# EAGLE design Mbus_2.0 (EAGLE 9.6.2)
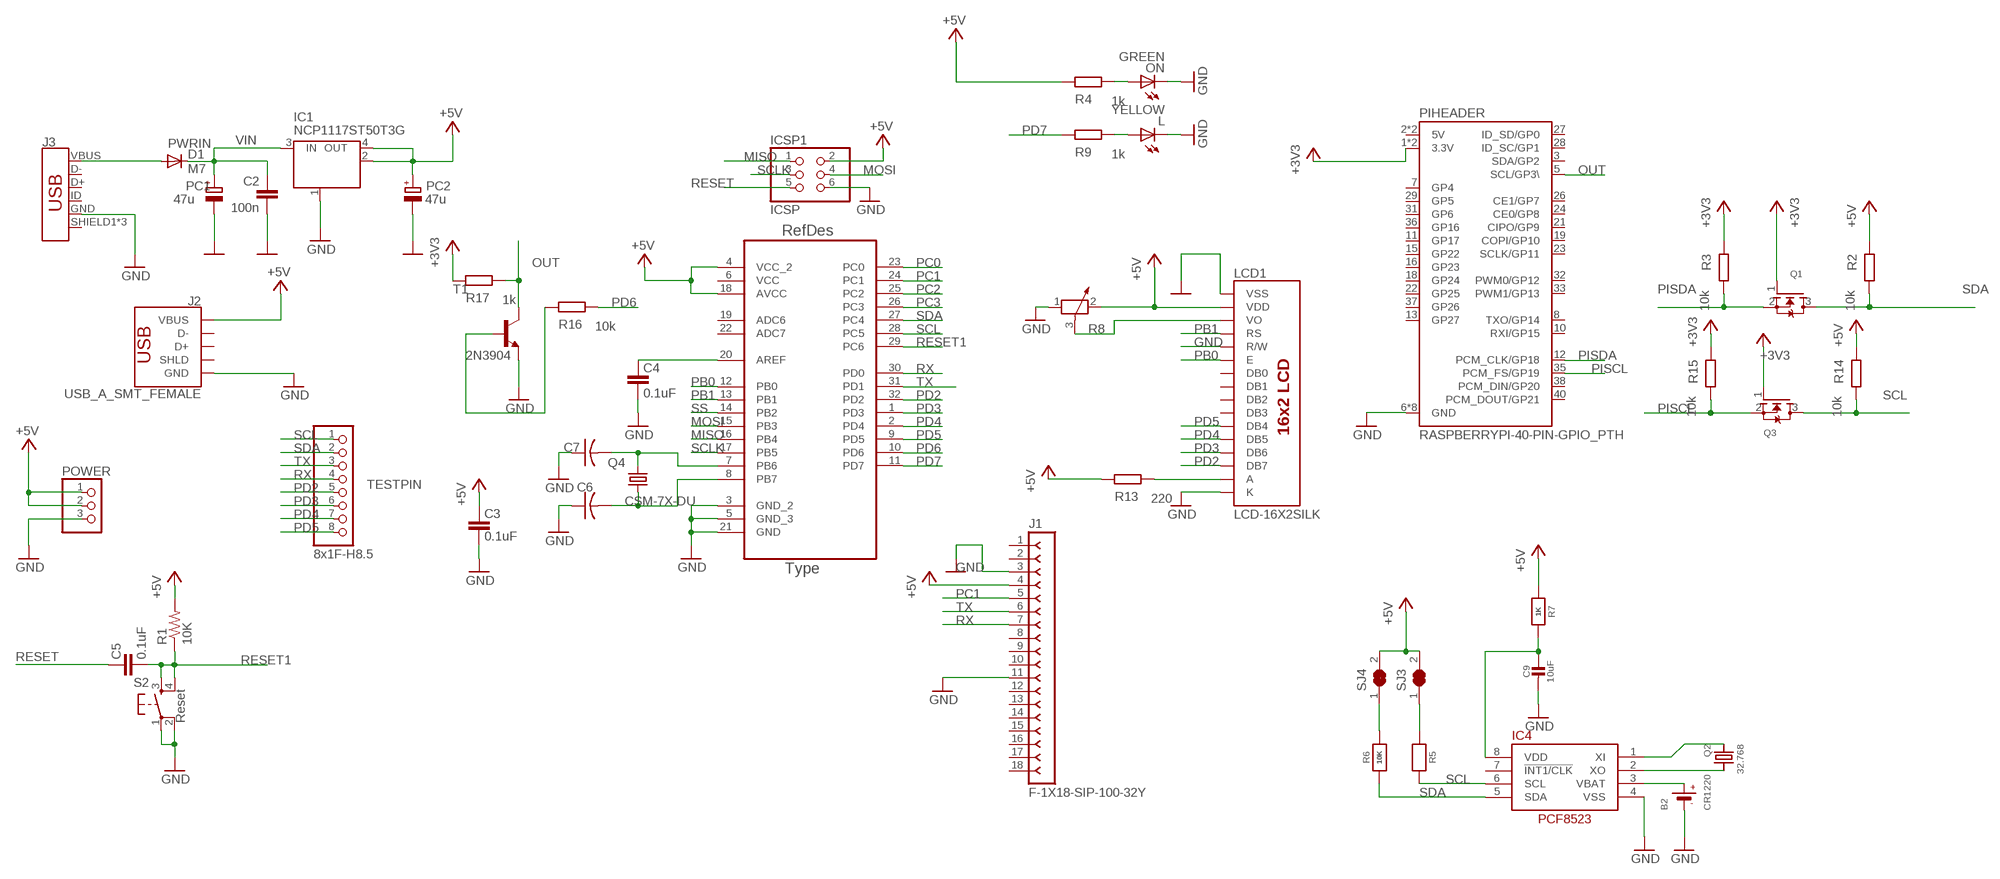
[diagram p0: schematic, sheet 1]

## Parts
B2  CR1220  BATTERYCR1220_SMT  [CR1220]
C2  100n  C-EU0603-RND  [C0603-ROUND]
C3  0.1uF  CAP0805  [0805]
C4  0.1uF  CAP0805  [0805]
C5  0.1uF  CAP0805  [0805]
C6  C-USC0805  [C0805]
C7  C-USC0805  [C0805]
C9  10uF  CAP_CERAMIC0805-NOOUTLINE  [0805-NO]
D1  M7  DIODE-SMB  [SMB]
IC1  NCP1117ST50T3G  MC33269ST-3.3T3  [SOT223]
IC4  RTC_PCF8523T  [SOIC8_150MIL]
ICSP1  ICSP  PINHD-2X3  [2X03]
J1  F-1X18-SIP-100-32Y  [SIP-100-18-32Y]
J2  USB_A_SMT_FEMALE  [USB-A-S-SILK-FEMALE]
J3  USB_MICRO-B_FEMALE-SMT  [USB-B-MICRO-SMD]
L  YELLOW  LEDCHIP-LED0805  [CHIP-LED0805]
LCD1  LCD-16X2SILK  [LCD-16X2]
ON  GREEN  LEDCHIP-LED0805  [CHIP-LED0805]
PC1  47u  CPOL-EUD  [PANASONIC_D]
PC2  47u  CPOL-EUD  [PANASONIC_D]
PIHEADER  RASPBERRYPI-40-PIN-GPIO_PTH  [2X20_SHROUDED]
POWER  PINHD-1X3  [1X03]
Q1  BSS138  MOSFET-NREFLOW  [SOT23]
Q2  32.768  CRYSTAL8.0X3.8  [CRYSTAL_8X3.8]
Q3  BSS138  MOSFET-NREFLOW  [SOT23]
Q4  CSM-7X-DU  [CSM-7X-DU]
R1  10K  RESISTOR  [0805]
R2  10k  R-EU_R0603  [R0603-ROUND]
R3  10k  R-EU_R0603  [R0603-ROUND]
R4  1k  R-EU_R0603  [R0603-ROUND]
R5  10K  RESISTOR0805_NOOUTLINE  [0805-NO]
R6  10K  RESISTOR0805_NOOUTLINE  [0805-NO]
R7  1K  RESISTOR0805_NOOUTLINE  [0805-NO]
R8  POTENTIOMETER_PT-10  [PT-10]
R9  1k  R-EU_R0603  [R0603-ROUND]
R13  220  R-EU_R0603  [R0603-ROUND]
R14  10k  R-EU_R0603  [R0603-ROUND]
R15  10k  R-EU_R0603  [R0603-ROUND]
R16  10k  R-EU_R0603  [R0603-ROUND]
R17  1k  R-EU_R0603  [R0603-ROUND]
S2  Reset  TAC_SWITCHSND  [TACTILE_SWITCH_SMD]
SJ3  SOLDERJUMPER_CLOSED  [SOLDERJUMPER_CLOSEDWIRE]
SJ4  SOLDERJUMPER_CLOSED  [SOLDERJUMPER_CLOSEDWIRE]
T1  2N3904  [TO92]
TESTPIN  8x1F-H8.5  PINHD-1X8  [1X08]
U1  ATMEGA328P-AU  [QFP80P900X900X120-32N]

## Nets
+3V3 [power]: PIHEADER.1(3.3V) PIHEADER.17(3.3V) Q1.1(G) Q3.1(G) R3.2 R15.2 R17.2
+5V [power]: C3.2 IC1.2(OUT) IC1.4(OUT) ICSP1.2 J1.4 J2.VBUS LCD1.2(VDD) PC2.+ POWER.1 POWER.2 R1.2 R2.2 R4.2 R7.1 R8.2 R13.2 R14.2 SJ3.2 SJ4.2 U1.4(VCC_2) U1.18(AVCC)
GND [gnd]: B2.- C2.2 C3.1 C4.1 C6.1 C7.1 C9.2 IC1.1(GND/ADJ) IC4.4(VSS) ICSP1.6 J1.3 J1.11 J2.GND J3.GND L.C LCD1.1(VSS) LCD1.5(R/W) LCD1.16(K) ON.C PC1.- PC2.- PIHEADER.6(GND) PIHEADER.9(GND) PIHEADER.14(GND) PIHEADER.20(GND) PIHEADER.25(GND) PIHEADER.30(GND) PIHEADER.34(GND) PIHEADER.39(GND) POWER.3 R8.1 S2.1 S2.2 T1.3(E) U1.3(GND_2) U1.5(GND_3) U1.21(GND)
MISO: ICSP1.1 U1.16(PB4)
MOSI: ICSP1.4 U1.15(PB3)
N$1: C6.2 Q4.1 U1.8(PB7)
N$2: L.A R9.1
N$3: ON.A R4.1
N$4: R16.2 T1.2(B)
N$6: IC4.1(XI) Q2.P$1
N$7: IC4.2(XO) Q2.P$4
N$8: R5.1 SJ3.1
N$9: R6.2 SJ4.1
N$10: C9.1 IC4.8(VDD) R7.2
N$11: LCD1.15(A) R13.1
N$13: C7.2 Q4.2 U1.7(PB6)
N$14: C4.2 U1.20(AREF)
N$22: LCD1.3(VO) R8.3
OUT: PIHEADER.5(SCL/GP3\) R17.1 T1.1(C)
PB0: LCD1.6(E) U1.12(PB0)
PB1: LCD1.4(RS) U1.13(PB1)
PC0: U1.23(PC0)
PC1: J1.5 U1.24(PC1)
PC2: U1.25(PC2)
PC3: U1.26(PC3)
PD2: LCD1.14(DB7) TESTPIN.5 U1.32(PD2)
PD3: LCD1.13(DB6) TESTPIN.6 U1.1(PD3)
PD4: LCD1.12(DB5) TESTPIN.7 U1.2(PD4)
PD5: LCD1.11(DB4) TESTPIN.8 U1.9(PD5)
PD6: R16.1 U1.10(PD6)
PD7: R9.2 U1.11(PD7)
PISCL: PIHEADER.35(PCM_FS/GP19) Q3.2(S) R15.1
PISDA: PIHEADER.12(PCM_CLK/GP18) Q1.2(S) R3.1
PWRIN [power]: D1.A J3.VBUS
RESET: C5.2 ICSP1.5
RESET1: C5.1 R1.1 S2.3 S2.4 U1.29(PC6)
RX: J1.7 TESTPIN.4 U1.30(PD0)
SCL: IC4.6(SCL) Q3.3(D) R5.2 R14.1 TESTPIN.1 U1.28(PC5)
SCLK: ICSP1.3 U1.17(PB5)
SDA: IC4.5(SDA) Q1.3(D) R2.1 R6.1 TESTPIN.2 U1.27(PC4)
SS: U1.14(PB2)
TX: J1.6 TESTPIN.3 U1.31(PD1)
VBAT1: B2.+$1(+) IC4.3(VBAT)
VIN [power]: C2.1 D1.C IC1.3(IN) PC1.+
Unconnected: IC4.7(!INT1/CLK) J1.1 J1.2 J1.8 J1.9 J1.10 J1.12 J1.13 J1.14 J1.15 J1.16 J1.17 J1.18 J2.D+ J2.D- J2.SHLD1(SHLD) J2.SHLD2(SHLD) J3.D+ J3.D- J3.ID J3.SHIELD1(SHIELD) J3.SHIELD2(SHIELD) J3.SHIELD3(SHIELD) LCD1.7(DB0) LCD1.8(DB1) LCD1.9(DB2) LCD1.10(DB3) PIHEADER.3(SDA/GP2) PIHEADER.7(GP4) PIHEADER.8(TXO/GP14) PIHEADER.10(RXI/GP15) PIHEADER.11(GP17) PIHEADER.13(GP27) PIHEADER.15(GP22) PIHEADER.16(GP23) PIHEADER.18(GP24) PIHEADER.19(COPI/GP10) PIHEADER.21(CIPO/GP9) PIHEADER.22(GP25) PIHEADER.23(SCLK/GP11) PIHEADER.24(CE0/GP8) PIHEADER.26(CE1/GP7) PIHEADER.27(ID_SD/GP0) PIHEADER.28(ID_SC/GP1) PIHEADER.29(GP5) PIHEADER.31(GP6) PIHEADER.32(PWM0/GP12) PIHEADER.33(PWM1/GP13) PIHEADER.36(GP16) PIHEADER.37(GP26) PIHEADER.38(PCM_DIN/GP20) PIHEADER.40(PCM_DOUT/GP21) U1.19(ADC6) U1.22(ADC7)

## Power pins joined to a net without a drawn wire
5V: PIHEADER.2(5V) PIHEADER.4(5V)
VCC: U1.6(VCC)

## Library data of the parts
B2 = microbuilder:BATTERY: CR1220 SMT - Digikey: 3001K-ND CD2032 BAT-HLD-001 - Digikey: BAT-HLD-001-ND
C2 = SmartPrj:C-EU: CAPACITOR, European symbol
C3-C5 = SparkFun:CAP: Capacitor Standard 0603 ceramic capacitor, and 0.1" leaded capacitor.
C6 C7 = rcl:C-US: CAPACITOR, American symbol
C9 = microbuilder:CAP_CERAMIC: Ceramic Capacitors For new designs, use the packages preceded by an '_' character since they are more reliable: The following footprints should be used on most boards: _0402 - Standard footprint for regular board layouts _0603 - Standard footprint for regular board layouts _0805 - Standard footprint for regular board layouts _1206 - Standard footprint for regular board layouts For extremely tight-pitch boards where space is at a premium, the following 'micro-pitch' footprints can be used (smaller pads, no silkscreen outline, etc.): _0402MP - Micro-pitch footprint for very dense/compact boards _0603MP - Micro-pitch footprint for very dense/compact boards _0805MP - Micro-pitch footprint for very dense/compact boards _1206MP - Micro-pitch footprint for very dense/compact boards
D1 = diode:DIODE-: DIODE
IC1 = linear:MC33269ST*: Adjustable Output Low Dropout Voltage Regulator 800 mA Source: http://www.onsemi.com/pub/Collateral/MC33269-D.PDF
IC4 = microbuilder:RTC_PCF8523
ICSP1 = pinhead:PINHD-2X3: PIN HEADER
J1 = con-headers-jp:F-1X18-: FEMALE HEADER
J2 = SparkFun-Connectors:USB_A: USB-A Connector Male and female variants, as well as PTH and SMT variants SparkFun Products: SparkFun XBee Explorer Dongle <https://www.sparkfun.com/products/11697> PTH Male SparkFun MicroView-USB Programmer <https://www.sparkfun.com/products/12924> SMT Male SparkFun USB Type A Female Breakout <https://www.sparkfun.com/products/12700> SMT Female; PROD_ID: CONN-09520; SF_ID: PRT-09011
J3 = SparkFun-Connectors:USB_MICRO-B: USB Type Micro-B Connector Male/female and PTH/SMT variants SparkFun Products: SparkFun microB USB Breakout <https://www.sparkfun.com/products/12035> SparkFun USB microB Plug Breakout <https://www.sparkfun.com/products/10031> SparkFun ESP8266 Thing <https://www.sparkfun.com/products/13231>; PROD_ID: CONN-11752
L ON = led:LED: LED OSRAM: - CHIPLED LG R971, LG N971, LY N971, LG Q971, LY Q971, LO R971, LY R971 LH N974, LH R974 LS Q976, LO Q976, LY Q976 LO Q996 - Hyper CHIPLED LW Q18S LB Q993, LB Q99A, LB R99A - SideLED LS A670, LO A670, LY A670, LG A670, LP A670 LB A673, LV A673, LT A673, LW A673 LH A674 LY A675 LS A676, LA A676, LO A676, LY A676, LW A676 LS A679, LY A679, LG A679 - Hyper Micro SIDELED® LS Y876, LA Y876, LO Y876, LY Y876 LT Y87S - SmartLED LW L88C, LW L88S LB L89C, LB L89S, LG L890 LS L89K, LO L89K, LY L89K LS L896, LA L896, LO L896, LY L896 - TOPLED LS T670, LO T670, LY T670, LG T670, LP T670 LSG T670, LSP T670, LSY T670, LOP T670, LYG T670 LG T671, LOG T671, LSG T671 LB T673, LV T673, LT T673, LW T673 LH T674 LS T676, LA T676, LO T676, LY T676, LB T676, LH T676, LSB T676, LW T676 LB T67C, LV T67C, LT T67C, LS T67K, LO T67K, LY T67K, LW E67C LS E67B, LA E67B, LO E67B, LY E67B, LB E67C, LV E67C, LT E67C LW T67C LS T679, LY T679, LG T679 LS T770, LO T770, LY T770, LG T770, LP T770 LB T773, LV T773, LT T773, LW T773 LH T774 LS E675, LA E675, LY E675, LS T675 LS T776, LA T776, LO T776, LY T776, LB T776 LHGB T686 LT T68C, LB T68C - Hyper Mini TOPLED® LB M676 - Mini TOPLED Santana® LG M470 LS M47K, LO M47K, LY M47K Source: http://www.osram.convergy.de/
LCD1 = SparkFun-Displays:LCD-16X2: Standard text-only 16x2 parallel input LCD Basic 16 character by 2 line display. Typically utilizes the extremely common HD44780 parallel interface chipset SparkFun Products: Basic 16x2 Green <https://www.sparkfun.com/products/255> Basic 8x2 Green <https://www.sparkfun.com/products/11122>; PROD_ID: LCD-12633; SF_ID: LCD-00255
PC1 PC2 = rcl:CPOL-EU: POLARIZED CAPACITOR, European symbol
PIHEADER = SparkFun-Connectors:RASPBERRYPI-40-PIN-GPIO: Raspberry Pi GPIO Header 2x20 pin connector, as found on B, B+, A+ models. Both shrouded PTH and SMT versions available. SparkFun Products: GPIO Shrouded Header <https://www.sparkfun.com/products/13054>- PTH SparkFun Pi Wedge (Preassembled) <https://www.sparkfun.com/products/13717>; PROD_ID: CONN-12263; SF_ID: PRT-13054
POWER = pinhead:PINHD-1X3: PIN HEADER
Q1 Q3 = adafruit:MOSFET-N: N-Channel Mosfet 2N7002E - 60V 260mA SOT23 [Digikey: 2N7002ET1GOSTR-ND] - REEL BSH103 - 30V 850mA SOT23 [Digikey: 568-5013-1-ND]
Q2 = microbuilder:CRYSTAL: Crystals HC49UP - Surface Mount Crystal 4.0MHz 18pF +/-30ppm Surface Mount Crystal [Digikey: 535-9857-1-ND] 12.0 MHz Surface Mount Crystal [Digikey: 535-9869-6-ND] 25.0 MHz Surface Mount Crystal [Digikey: 535-9078-1-ND] 2.5 x 2.0mm - MEMs SMT Crystal 16.0 MHz 10pF 20ppm 2.5 x 2.0mm Crystal [Digikey -40-85°C: 535-10923-1-ND] 3.2 x 2.5mm - MEMs SMT Crystal 12.0 MHz 8pF 15ppm 3.2 x 2.5mm Crystal [Digikey: -10-70°C: 644-1047-1-ND -40-125°C: 644-1128-1-ND] 40~85°C cheaper: 644-1173-6-ND 16.0 MHz 8pF 15ppm 3.2 x 2.5mm Crystal [Digikey: -10-70°C: 644-1049-1-ND -40-125°C: 644-1129-2-ND]-40~85°C cheaper: 644-1175-6-ND 16.0 MHz 10pF 10ppm 3.2 x 2.5mm Crystal [Digikey: 644-1100-1-ND] 27.12 MHz 18pF 30ppm 3.2 x 2.5mm Crystal [Digikey: 887-1424-1-ND] 27.12MHz 10pF 10ppm 3.2 x 2.5mm Crystal [Digikey: 887-1329-1-ND] 4.9 x 1.8mm - MEMs SMT Crystal 32.768 KHz 12.5pF 20ppm 4.9 x 1.8mm Crystal [Digikey: SE2415CT-ND] 8.0 x 3.8mm - Surface Mount Crystal 32.768kHz 12.5pF 20ppm -40°C-85°C [Digikey: 535-9166-2-ND] Cylinder 32.768KHz Cylinder Crystal (2x6mm body) [Ex. Digikey: 300-8341-2-ND]
Q4 = crystal:CSM-7X-DU: SMD CRYSTAL Source: www.ecsxtal.com .. Crystal 3.6864MHz CSM_7X_DU.PDF; OC_FARNELL: unknown; OC_NEWARK: unknown
R1 = SparkFun:RESISTOR: Resistor Basic schematic elements and footprints for 0603, 1206, and PTH 1/10th watt (small) resistors.
R2-R4 R9 R13-R17 = SmartPrj:R-EU_: RESISTOR, European symbol
R5-R7 = microbuilder:RESISTOR: Resistors For new designs, use the packages preceded by an '_' character since they are more reliable: The following footprints should be used on most boards: _0402 - Standard footprint for regular board layouts _0603 - Standard footprint for regular board layouts _0805 - Standard footprint for regular board layouts _1206 - Standard footprint for regular board layouts For extremely tight-pitch boards where space is at a premium, the following 'micro-pitch' footprints can be used (smaller pads, no silkscreen outline, etc.): _0402MP - Micro-pitch footprint for very dense/compact boards _0603MP - Micro-pitch footprint for very dense/compact boards _0805MP - Micro-pitch footprint for very dense/compact boards _1206MP - Micro-pitch footprint for very dense/compact boards
R8 = rcl@1:POTENTIOMETER_: Potentiometer; SPICEMODEL: POT; SPICEPREFIX: X
S2 = SparkFun:TAC_SWITCH: Momentary Switch Button commonly used for reset or general input. Spark Fun Electronics SKU : COM-00097
SJ3 SJ4 = microbuilder:SOLDERJUMPER_CLOSED: Solder Jumper - Closed These solder jumpers are closed by default CLOSEDWIRE - 10 mil trace between pads that can be cut and resoldered later CLOSEDPERM - 63 mil trace between pads for a permanent connection (used to 'bridge' two signals, a shameless hack for Eagle). Can double as a test point as well (no cream layer)
T1 = transistor:2N3904: NPN TRANSISTOR
TESTPIN = SmartPrj:PINHD-1X8: PIN HEADER
U1 = Atmel-ATMEGA328P-AU:ATMEGA328P-AU; DESCRIPTION: 8-bit Microcontroller with In-System Programmable Flash; MPN: ATMEGA328P-AU; OC_FARNELL: 1715486; OC_NEWARK: 14R4631; PACKAGE: TQFP-32; SUPPLIER: Atmel

## Net classes
0 default: width 0.203 mm, drill 0.254 mm, clearance 0.203 mm
1 power: width 0.813 mm, drill 0.864 mm, clearance 0.254 mm
2 gnd: width 0.61 mm, drill 0.66 mm, clearance 0.254 mm
3 usbvcc: width 0.508 mm, drill 0.508 mm, clearance 0.254 mm
4 aref: width 0.406 mm, clearance 0.254 mm

## Board
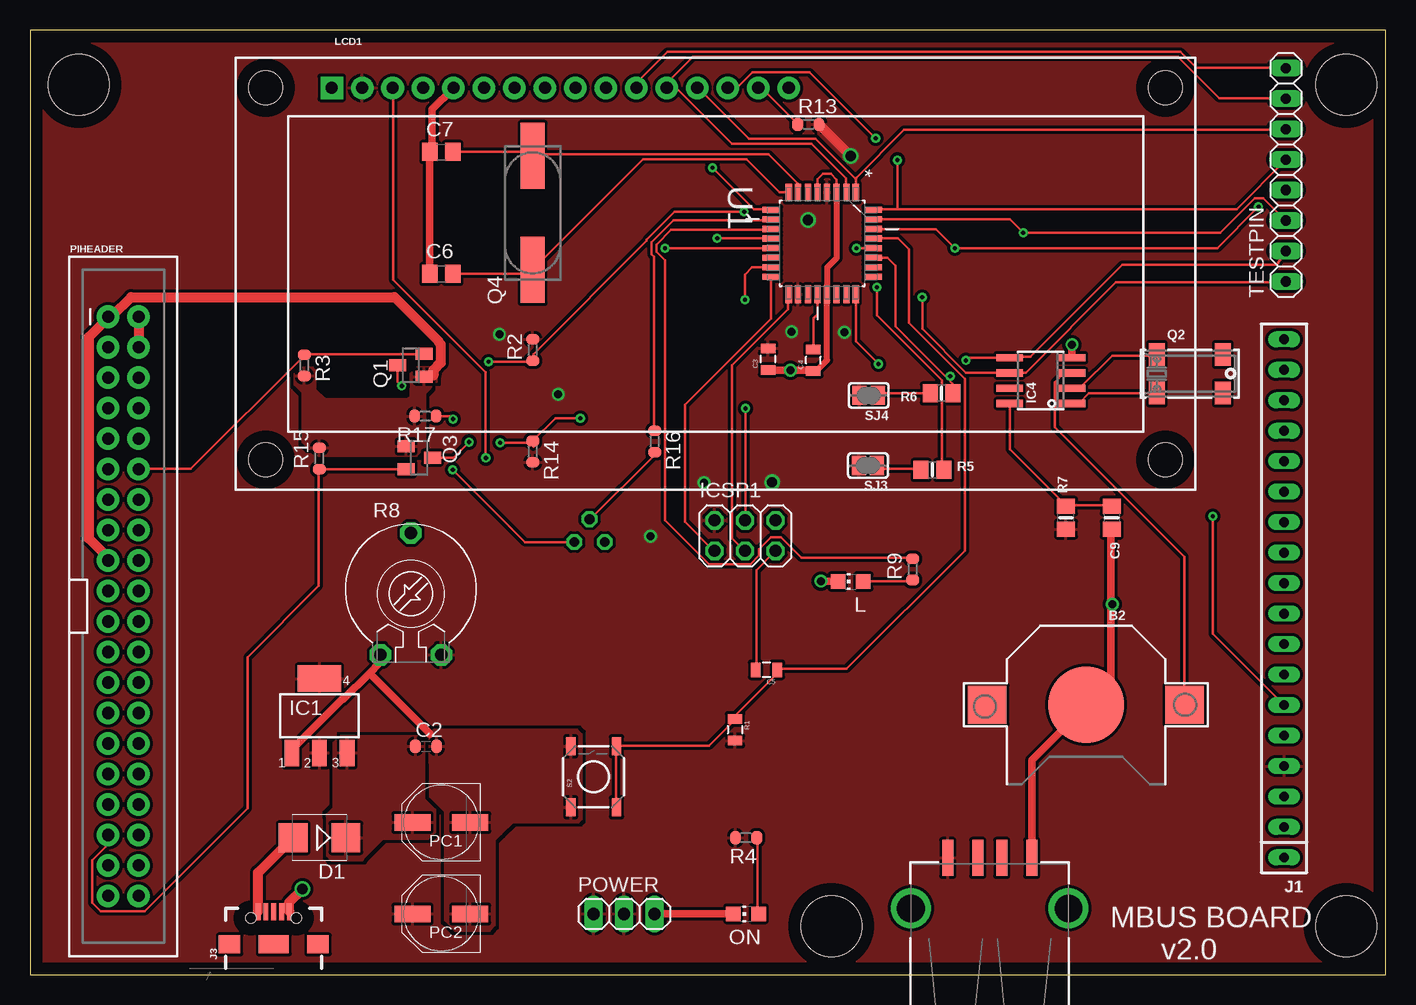
[diagram p1: board, top side]
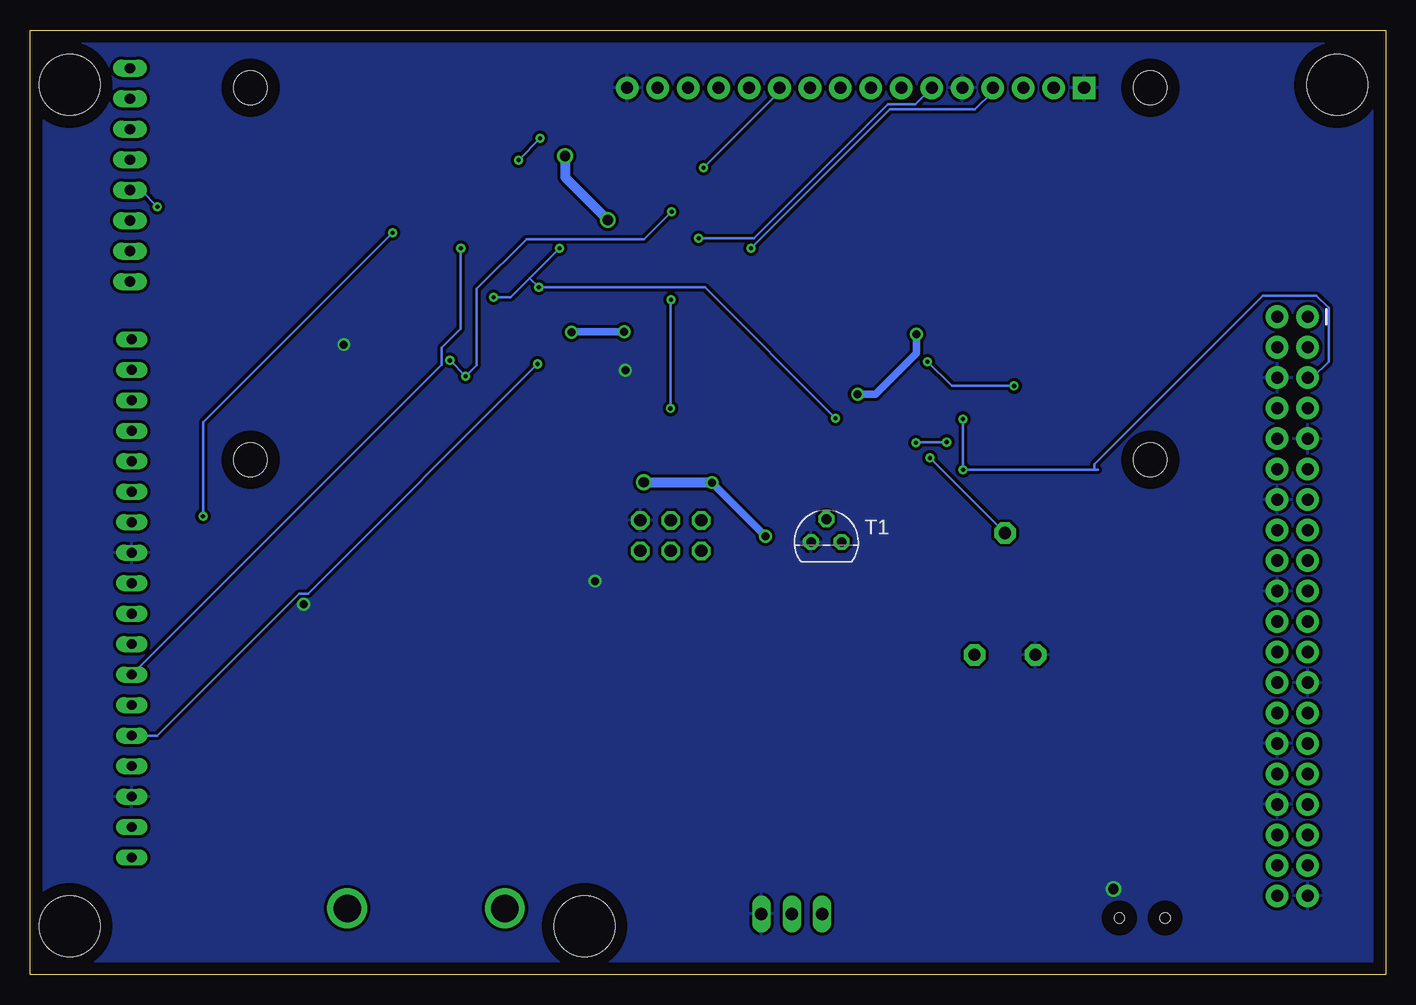
[diagram p2: board, bottom side, seen from below]

Size 113.03 x 78.74 mm. Coordinates in mm from the lower left corner, seen from the top.
Outline: 0,0 113.03,0 113.03,78.74 0,78.74 0,0
Copper layers (1*16): Top 0.035mm / dielectric 1.5mm / Bottom 0.035mm
Design rules "default": minimum track width 6mil, minimum drill 0.35mm, track to track 6mil, track to pad 6mil, pad to pad 6mil, via to via 6mil, smd to smd 6mil, copper to edge 40mil, drill to drill 6mil, minimum pad ring 10mil, minimum via ring 8mil, stop-mask expansion 4mil, vias tented up to drill 0mil, thermal gap 10mil
Holes 5.08 mm at 4.06,74.17 109.73,74.17 109.73,4.06 66.8,4.06

### Footprints (pad centres in the part's own frame; a part is rotated, then mirrored left to right if it is on the bottom)
CR1220 = smd 3.2 x 3.2: +$1 -8.225,0; +$2 8.225,0 | smd 6.35 x 6.35: - 0,0
C0603-ROUND = smd 0.898 x 1.1: 1 -0.889,0; 2 0.889,0
0805 = smd 0.8 x 1.2: 1 -0.9,0; 2 0.9,0
C0805 = smd 1.3 x 1.5: 1 -0.95,0; 2 0.95,0
0805-NO = smd 1.24 x 1.5: 1 -0.95,0; 2 0.95,0
SMB = smd 2.4 x 2.4: A 2.2,0; C -2.2,0
SOT223 = smd 1.219 x 2.235: 1 -2.311,-3.099; 2 0,-3.099; 3 2.311,-3.099 | smd 3.6 x 2.2: 4 0,3.099
SOIC8_150MIL = smd 0.6 x 2.2: 1 -1.905,-2.6; 2 -0.635,-2.6; 3 0.635,-2.6; 4 1.905,-2.6; 5 1.905,2.6; 6 0.635,2.6; 7 -0.635,2.6; 8 -1.905,2.6
2X03 = drill 1.016 octagon: 1 -2.54,-1.27; 2 -2.54,1.27; 3 0,-1.27; 4 0,1.27; 5 2.54,-1.27; 6 2.54,1.27
SIP-100-18-32Y = drill 0.813 long: 1 -21.59,0; 2 -19.05,0; 3 -16.51,0; 4 -13.97,0; 5 -11.43,0; 6 -8.89,0; 7 -6.35,0; 8 -3.81,0; 9 -1.27,0; 10 1.27,0; 11 3.81,0; 12 6.35,0; 13 8.89,0; 14 11.43,0; 15 13.97,0; 16 16.51,0; 17 19.05,0; 18 21.59,0
USB-A-S-SILK-FEMALE = smd 3 x 0.9: D+ 7.212,-1; D- 7.212,1; GND 7.212,-3.5; VBUS 7.212,3.5 | drill 2.311: SHLD1 3,-6.566; SHLD2 3,6.566
USB-B-MICRO-SMD = smd 1.45 x 0.4: D+ 2.725,0; D- 2.725,0.65; GND 2.725,-1.3; ID 2.725,-0.65; VBUS 2.725,1.3 | smd 1.5 x 1.8: SHIELD1 0,3.685; SHIELD2 0,-3.685 | smd 1.5 x 2.5: SHIELD3 0,0 | hole 0.85: 2.2,1.9; 2.2,-1.9
CHIP-LED0805 = smd 1.2 x 1.2: A 0,-1.05; C 0,1.05
LCD-16X2 = drill 1.016 pad 1.88 square: 1 -32,15.5 | drill 1.016 pad 1.88: 2 -29.46,15.5; 3 -26.92,15.5; 4 -24.38,15.5; 5 -21.84,15.5; 6 -19.3,15.5; 7 -16.76,15.5; 8 -14.22,15.5; 9 -11.68,15.5; 10 -9.14,15.5; 11 -6.6,15.5; 12 -4.06,15.5; 13 -1.52,15.5; 14 1.02,15.5; 15 3.56,15.5; 16 6.1,15.5 | hole 2.8: -37.5,15.5; -37.5,-15.5; 37.5,15.5; 37.5,-15.5
PANASONIC_D = smd 3 x 1.4: + 2.4,0; - -2.4,0
2X20_SHROUDED = drill 1.016 pad 1.88: 1 -1.27,24.13; 2 1.27,24.13; 3 -1.27,21.59; 4 1.27,21.59; 5 -1.27,19.05; 6 1.27,19.05; 7 -1.27,16.51; 8 1.27,16.51; 9 -1.27,13.97; 10 1.27,13.97; 11 -1.27,11.43; 12 1.27,11.43; 13 -1.27,8.89; 14 1.27,8.89; 15 -1.27,6.35; 16 1.27,6.35; 17 -1.27,3.81; 18 1.27,3.81; 19 -1.27,1.27; 20 1.27,1.27; 21 -1.27,-1.27; 22 1.27,-1.27; 23 -1.27,-3.81; 24 1.27,-3.81; 25 -1.27,-6.35; 26 1.27,-6.35; 27 -1.27,-8.89; 28 1.27,-8.89; 29 -1.27,-11.43; 30 1.27,-11.43; 31 -1.27,-13.97; 32 1.27,-13.97; 33 -1.27,-16.51; 34 1.27,-16.51; 35 -1.27,-19.05; 36 1.27,-19.05; 37 -1.27,-21.59; 38 1.27,-21.59; 39 -1.27,-24.13; 40 1.27,-24.13
1X03 = drill 1.016 long: 1 -2.54,0; 2 0,0; 3 2.54,0
SOT23 = smd 1 x 1.4: 1 -0.95,-1.1; 2 0.95,-1.1; 3 0,1.1
CRYSTAL_8X3.8 = smd 1.3 x 1.9: P$1 -2.75,-1.6; P$2 2.75,-1.6; P$3 2.75,1.6; P$4 -2.75,1.6
CSM-7X-DU = smd 5.5 x 2: 1 -4.75,0; 2 4.75,0
R0603-ROUND = smd 0.898 x 1.1: 1 -0.889,0; 2 0.889,0
PT-10 = drill 1.016 pad 1.778 octagon: 1 -2.54,-5.08; 2 2.54,-5.08; 3 0,5.08
TACTILE_SWITCH_SMD = smd 1.524 x 0.762: 1 -2.54,1.905; 2 2.54,1.905; 3 -2.54,-1.905; 4 2.54,-1.905
SOLDERJUMPER_CLOSEDWIRE = smd 1.168 x 1.6: 1 -0.762,0; 2 0.762,0 | smd 0.635 x 0.203: WIRE 0,0
TO92 = drill 0.813 octagon: 1 1.27,0; 2 0,1.905; 3 -1.27,0
1X08 = drill 0.85 pad 1.422 long: 1 -8.89,0; 2 -6.35,0; 3 -3.81,0; 4 -1.27,0; 5 1.27,0; 6 3.81,0; 7 6.35,0; 8 8.89,0
QFP80P900X900X120-32N = smd 1.473 x 0.508: 1 -4.242,2.794; 2 -4.242,2.007; 3 -4.242,1.194; 4 -4.242,0.406; 5 -4.242,-0.406; 6 -4.242,-1.194; 7 -4.242,-2.007; 8 -4.242,-2.794; 17 4.242,-2.794; 18 4.242,-2.007; 19 4.242,-1.194; 20 4.242,-0.406; 21 4.242,0.406; 22 4.242,1.194; 23 4.242,2.007; 24 4.242,2.794 | smd 0.508 x 1.473: 9 -2.794,-4.242; 10 -2.007,-4.242; 11 -1.194,-4.242; 12 -0.406,-4.242; 13 0.406,-4.242; 14 1.194,-4.242; 15 2.007,-4.242; 16 2.794,-4.242; 25 2.794,4.242; 26 2.007,4.242; 27 1.194,4.242; 28 0.406,4.242; 29 -0.406,4.242; 30 -1.194,4.242; 31 -2.007,4.242; 32 -2.794,4.242

### Placement (x,y rotation side)
B2  88.03,22.51 180 top
C2  33.02,19.05 0 top
C3  61.54,51.31 90 top
C4  65.31,51.23 90 top
C5  61.39,25.42 180 top
C6  34.29,58.42 0 top
C7  34.29,68.58 0 top
C9  90.17,38.1 270 top
D1  24.13,11.43 180 top
IC1  24.13,21.59 0 top
IC4  84.26,49.53 90 top
ICSP1  59.61,36.6 0 top
J1  104.55,31.37 90 top
J2  80.01,2.54 90 top
J3  20.32,2.54 90 top
L  68.41,32.78 90 top
LCD1  57.15,58.42 0 top
ON  59.69,5.08 90 top
PC1  34.29,12.7 180 top
PC2  34.29,5.08 180 top
PIHEADER  7.79,30.71 0 top
POWER  49.53,5.08 0 top
Q1  31.75,50.8 90 top
Q2  96.69,50.1 0 top
Q3  32.45,43.1 270 top
Q4  41.91,63.5 90 top
R1  58.77,20.42 270 top
R2  41.91,52.07 90 top
R3  22.86,50.8 270 top
R4  59.69,11.43 180 top
R5  75.23,42.09 0 top
R6  76,48.47 180 top
R7  86.36,38.1 90 top
R8  31.75,31.75 0 top
R9  73.58,33.79 90 top
R13  64.89,70.87 0 top
R14  41.91,43.6 270 top
R15  24.11,43.04 90 top
R16  52.07,44.45 270 top
R17  32.96,46.56 180 top
S2  46.99,16.51 90 top
SJ3  69.86,42.45 180 top
SJ4  69.92,48.29 180 top
T1  46.64,36.07 0 bottom
TESTPIN  104.69,66.67 90 top
U1  66.04,60.96 270 top

### Tracks (layer width: path | path; a pad name or v marks a point on that pad's centre or on a via)
5V
  Top 0.813: PIHEADER.4 9.04,52.32 9.04,54.76 PIHEADER.2
+3V3
  Top 0.813: 33.63,49.95 33.63,50.39 34.24,51 34.24,52.53 34.04,52.83 30.38,56.49 8.43,56.49 6.91,54.97 PIHEADER.1 6.5,54.76 4.88,53.14 4.88,36.37 6.5,34.75 6.5,34.54 PIHEADER.17
  pour Top: 22.05,50.44 22.05,49.2 22.72,48.53 22.72,44.37 23.83,43.27 32.22,43.27 32.95,44 32.95,48.45 33.92,49.41 33.92,50.22 33.5,50.63 32.28,50.63 31.73,50.08 31.73,48.19 31.49,47.95 24.66,47.95 23.79,48.82 23.79,50.38 23.55,50.61 22.23,50.61
+5V  (via drill 0.66, 0.86)
  Top 0.813: R13.2 68.41,68.25 v68.42,68.25
  Bottom 0.61: v56.19,41.02 v51.73,36.56 | v63.49,53.59 67.86,53.59 v67.88,53.56 | v39.13,53.38 39.13,51.82 42.56,48.38 v44.04,48.38
  Bottom 0.813: v56.19,41.02 61.83,41.02 v61.86,41.05 | v68.42,68.25 68.42,66.47 v64.86,62.91
  pour Top (rank 2): -4.75,-4.05 -2.29,-6.52 115.44,-6.52 115.97,-5.99 118.26,-3.7 118.26,80.69 -4.05,80.69
GND  (via drill 0.66, 0.86)
  Top 0.203: U1.3 67.23,66.28 66.75,66.76 66.1,66.76 65.63,66.29 U1.5
  Top 0.508: U1.3 67.23,59.73 66.45,58.94 U1.21 66.45,51.23 65.55,50.33 C4.1
  Top 0.61: 90.12,30.89 90.12,24.59 88.09,22.55 B2.- 87.88,22.25 83.52,17.88 J2.GND | 90.12,30.89 90.12,37.08 C9.2 | C6.1 33.33,58.42 33.33,68.58 C7.1 33.53,68.78 33.53,72.14 35.26,73.86 LCD1.5 | C3.1 61.57,50.39 v63.4,50.39 65.23,50.39 C4.1 | POWER.3 ON.C | v65.94,32.82 67.36,32.82 L.C | v86.87,52.53 86.87,51.51 IC4.4 | 28.3,25.15 29.16,26.01 29.16,26.62 R8.1 | 28.3,25.15 26.11,22.96 26.01,22.96 21.84,18.8 21.84,18.49 IC1.1 | 28.3,25.15 33.33,20.12 33.33,20.07 | v90.22,30.89 90.12,30.89
  Top 0.813: J3.GND 21.62,6.06 v22.71,7.15
  pour Bottom: -8.89,-10.16 123.19,-10.16 124.46,-8.89 124.46,87.63 -8.89,87.63
  pour Top: 33.33,20.07 33.33,17.66 33.36,17.63 33.36,14.85 34.6,13.6 34.6,4.54 35.46,3.69 38.32,3.69 38.75,4.12 38.75,11.21 39.29,11.75 40.25,12.72 45.73,12.72 45.99,12.97 45.99,20.04 45.59,20.44 33.7,20.44
MISO
  Top 0.203: U1.16 61.77,58.12 61.77,54.66 54.61,47.5 54.61,37.74 57,35.36 ICSP1.1
MOSI  (via drill 0.35)
  Top 0.203: 61.87,58.93 U1.15 60.2,58.96 59.59,58.36 v59.59,56.26 | ICSP1.4 59.64,37.9 v59.64,47.2 v59.65,47.2
  Bottom 0.203: v59.65,47.2 59.65,56.2 v59.59,56.26
N$1
  Top 0.203: U1.8 63.2,65.23 62.48,65.23 59.74,67.97 51.1,67.97 41.96,58.83 Q4.1 41.86,58.73 41.55,58.42 C6.2
N$2
  Top 0.203: R9.1 73.56,32.82 69.49,32.82 L.A
N$3
  Top 0.203: R4.1 60.66,11.38 60.66,5.08 ON.A
N$4
  Top 0.203: R16.2 52.02,43.48 52.02,43.28 46.74,38 T1.2
N$6
  Top 0.203: Q2.P$1 93.88,48.46 88.29,48.46 87.48,47.65 86.87,47.65 IC4.1
N$7
  Top 0.203: Q2.P$4 93.88,51.61 90.22,51.61 87.58,48.97 86.87,48.97 IC4.2
N$8
  Top 0.203: R5.1 74.27,42.16 70.92,42.16 70.71,42.37 SJ3.1
N$9
  Top 0.203: R6.2 74.98,48.46 70.81,48.46 70.71,48.36 SJ4.1
N$10
  Top 0.203: 86.36,39.12 90.12,39.12 C9.1 | 86.36,39.12 81.69,43.79 81.69,47.55 IC4.8 | 86.36,39.12 R7.2
N$11
  Top 0.203: R13.1 60.96,73.92 LCD1.15
N$13
  Top 0.203: U1.7 64.01,65.23 64.01,65.94 61.57,68.38 42.06,68.38 41.96,68.28 Q4.2 41.86,68.28 41.55,68.58 C7.2
N$14
  Top 0.203: U1.20 65.63,55.01 65.33,54.71 65.33,52.22 C4.2
N$22  (via drill 0.35)
  Top 0.203: v38,43.08 38,50.22 30.28,57.94 30.28,73.86 LCD1.3
  Bottom 0.203: v38,43.08 R8.3
OUT  (via drill 0.35)
  Top 0.203: T1.1 41.28,36.07 v35.24,42.11 | R17.1 35.03,46.56 v35.27,46.32
  Bottom 0.203: 24.28,42.11 v35.24,42.11 35.27,42.13 v35.27,46.32 | 24.28,42.11 24.02,42.11 | 24.28,42.11 24.28,42.57 10.26,56.59 5.79,56.59 4.78,55.58 4.78,51.1 6.1,49.78 6.5,49.78 PIHEADER.5
PB0  (via drill 0.35)
  Top 0.203: U1.12 57.3,61.37 v57.29,61.38
  Bottom 0.203: v57.29,61.38 52.68,61.38 41.52,72.54 39.23,72.54 LCD1.6
PB1  (via drill 0.35)
  Top 0.203: v52.93,60.55 U1.13
  Bottom 0.203: v52.93,60.55 41.35,72.14 34.24,72.14 32.82,73.56 32.82,73.86 LCD1.4
PC1  (via drill 0.35)
  Top 0.203: U1.24 68.83,52.8 v70.73,50.91
  Bottom 0.203: v70.73,50.91 89.86,31.77 90.59,31.77 102.42,19.94 J1.5
PD2  (via drill 0.35)
  Top 0.203: 72.33,63.8 100.58,63.8 104.65,67.87 TESTPIN.5 | 72.33,63.8 70.31,63.8 U1.32 70.21,63.7 | LCD1.14 58.95,73.92 60.24,75.22 64.99,75.22 v70.5,69.71 | v72.31,67.9 72.31,63.83 72.33,63.8
  Bottom 0.203: v70.5,69.71 v72.31,67.9
PD3
  Top 0.203: LCD1.13 55.68,73.92 59.94,69.66 65.5,69.66 68.81,66.35 68.83,66.38 | 68.78,65.23 U1.1 68.83,66.38 | TESTPIN.6 104.65,70.41 72.86,70.41 68.89,66.43 68.83,66.38
PD4
  Top 0.203: 67.97,65.13 U1.2 68.02,65.23 68.02,66.4 65.17,69.25 58.54,69.25 53.87,73.92 LCD1.12 53.09,74.32 55.27,76.5 95.71,76.5 99.16,73.05 104.65,73.05 TESTPIN.7
PD5  (via drill 0.35)
  Top 0.203: v56.9,67.26 60.35,63.8 61.77,63.8 U1.9 | TESTPIN.8 104.65,75.59 97.23,75.59 95.91,76.91 53.14,76.91 50.55,74.32 LCD1.11
  Bottom 0.203: v56.9,67.26 50.6,73.56 50.6,73.86 LCD1.11 50.6,73.97
PD6
  Top 0.203: R16.1 52.02,45.41 52.02,59.84 51.82,60.05 51.82,61.06 53.65,62.89 61.77,62.89 U1.10
PD7
  Top 0.203: R9.2 73.56,34.75 64.31,34.75 62.59,36.47 61.77,36.47 60.76,35.46 60.76,34.95 60.05,34.24 56.59,34.24 52.93,37.9 52.93,59.54 52.22,60.25 52.22,60.86 53.44,62.08 61.77,62.08 U1.11
PISCL
  Top 0.203: 24.16,42.17 R15.1 | 31.33,42.23 31.34,42.21 | 31.34,42.21 Q3.2 | R15.1 24.08,42.1 24.08,32.41 18.14,26.47 18.14,13.87 9.55,5.28 5.89,5.28 5.18,5.99 5.18,9.55 6.5,10.87 6.5,11.58 PIHEADER.35 | R15.1 31.28,42.15 31.34,42.21
PISDA
  Top 0.203: Q1.2 32.82,51.71 22.86,51.71 R3.1 22.86,51.61 13.41,42.16 9.14,42.16 PIHEADER.12
PWRIN
  Top 0.813: J3.VBUS 19.02,8.52 D1.A
RESET
  Top 0.203: C5.2 60.55,25.5 60.55,33.73 62.08,35.26 ICSP1.5
RESET1
  Top 0.203: S2.3 48.87,14.02 48.87,19 S2.4 48.97,19.1 56.59,19.1 58.73,21.23 R1.1 58.83,21.34 58.83,21.64 62.28,25.09 62.28,25.4 C5.1 62.38,25.5 68.07,25.5 77.93,35.36 77.93,49.68 73.26,54.35 73.26,60.48 72.37,61.37 U1.29
RX  (via drill 0.35)
  Top 0.203: 70.31,62.18 U1.30 75.52,62.15 v77.11,60.56 98.96,60.56 v102.41,64.01
  Bottom 0.203: v102.41,64.01 103.73,65.33 104.65,65.33 TESTPIN.4 | v77.11,60.56 77.11,53.87 78.71,52.27 78.71,50.86 J1.7
SCL  (via drill 0.35)
  Top 0.203: 41.96,43.99 41.96,44.4 | 41.96,44.4 R14.1 43.81,46.4 v45.88,46.4 | 33.57,43.05 Q3.3 35.31,43.1 v36.61,44.4 | v68.89,60.55 U1.28 | v74.38,56.47 74.38,53.84 78.03,50.19 81.58,50.19 IC4.6 81.69,50.19 83.01,50.19 90.53,57.71 104.65,57.71 TESTPIN.1 | v70.61,57.3 70.61,54.97 76.02,49.56 76.02,42.23 R5.2 76.1,42.06 | v39.18,44.34 41.9,44.34 41.96,44.4
  Bottom 0.203: v74.38,56.47 72.97,56.47 71.37,58.06 | 71.37,58.06 v68.89,60.55 | 71.37,58.06 v70.61,57.3 56.78,57.3 v45.88,46.4 | v36.61,44.4 39.12,44.4 v39.18,44.34
SCLK
  Top 0.203: U1.17 63.2,56.69 63.2,55.47 58.52,50.8 58.52,36.37 59.54,35.36 ICSP1.3
SDA  (via drill 0.35)
  Top 0.203: TESTPIN.2 103.95,59.16 91.05,59.16 83.4,51.51 81.69,51.51 IC4.5 81.58,51.41 78.23,51.41 v78.03,51.21 | v38.22,51.1 41.86,51.1 R2.1 41.96,51.21 41.96,51.71 51.41,61.16 51.41,61.27 53.75,63.6 v59.54,63.6 | 30.68,50.8 Q1.3 30.65,49.42 v30.99,49.08 | 76.5,49.68 76.91,49.28 76.91,48.56 R6.1 | 76.5,49.68 72.15,54.04 72.15,59.09 71.5,59.74 70.31,59.74 U1.27 70.21,59.84 | 76.5,49.68 v76.71,49.89
  Bottom 0.203: v78.03,51.21 v76.71,49.89 75.79,50.8 75.79,57.17 71.65,61.3 61.83,61.3 v59.54,63.6 | v38.22,51.1 36.19,49.08 v30.99,49.08
TX  (via drill 0.35)
  Top 0.203: 70.31,62.99 U1.31 81.68,62.97 v82.8,61.85 99.23,61.85 102.11,64.72 102.82,64.72 104.65,62.89 TESTPIN.3 | J1.6 98.61,28.43 v98.61,38.21
  Bottom 0.203: v98.61,38.21 98.61,46.04 v82.8,61.85
VBAT1
  Top 0.203: IC4.3 86.77,50.09 86.16,50.09 85.45,49.38 85.45,45.62 96.22,34.85 96.22,22.55 B2.+$1
VIN
  pour Top: 24.75,13.34 24.75,9.91 25.1,9.57 27.68,9.57 27.79,9.68 29.44,11.33 33.19,11.33 33.75,11.89 33.75,13.77 32.84,14.68 32.84,19.33 32.28,19.9 30.72,19.9 25.89,19.9 25.32,19.33 25.32,13.94 24.72,13.34

### Text on the board
tNames: MBUS BOARD / v2.0